# EAGLE design VL6180 (EAGLE 6.5.0)
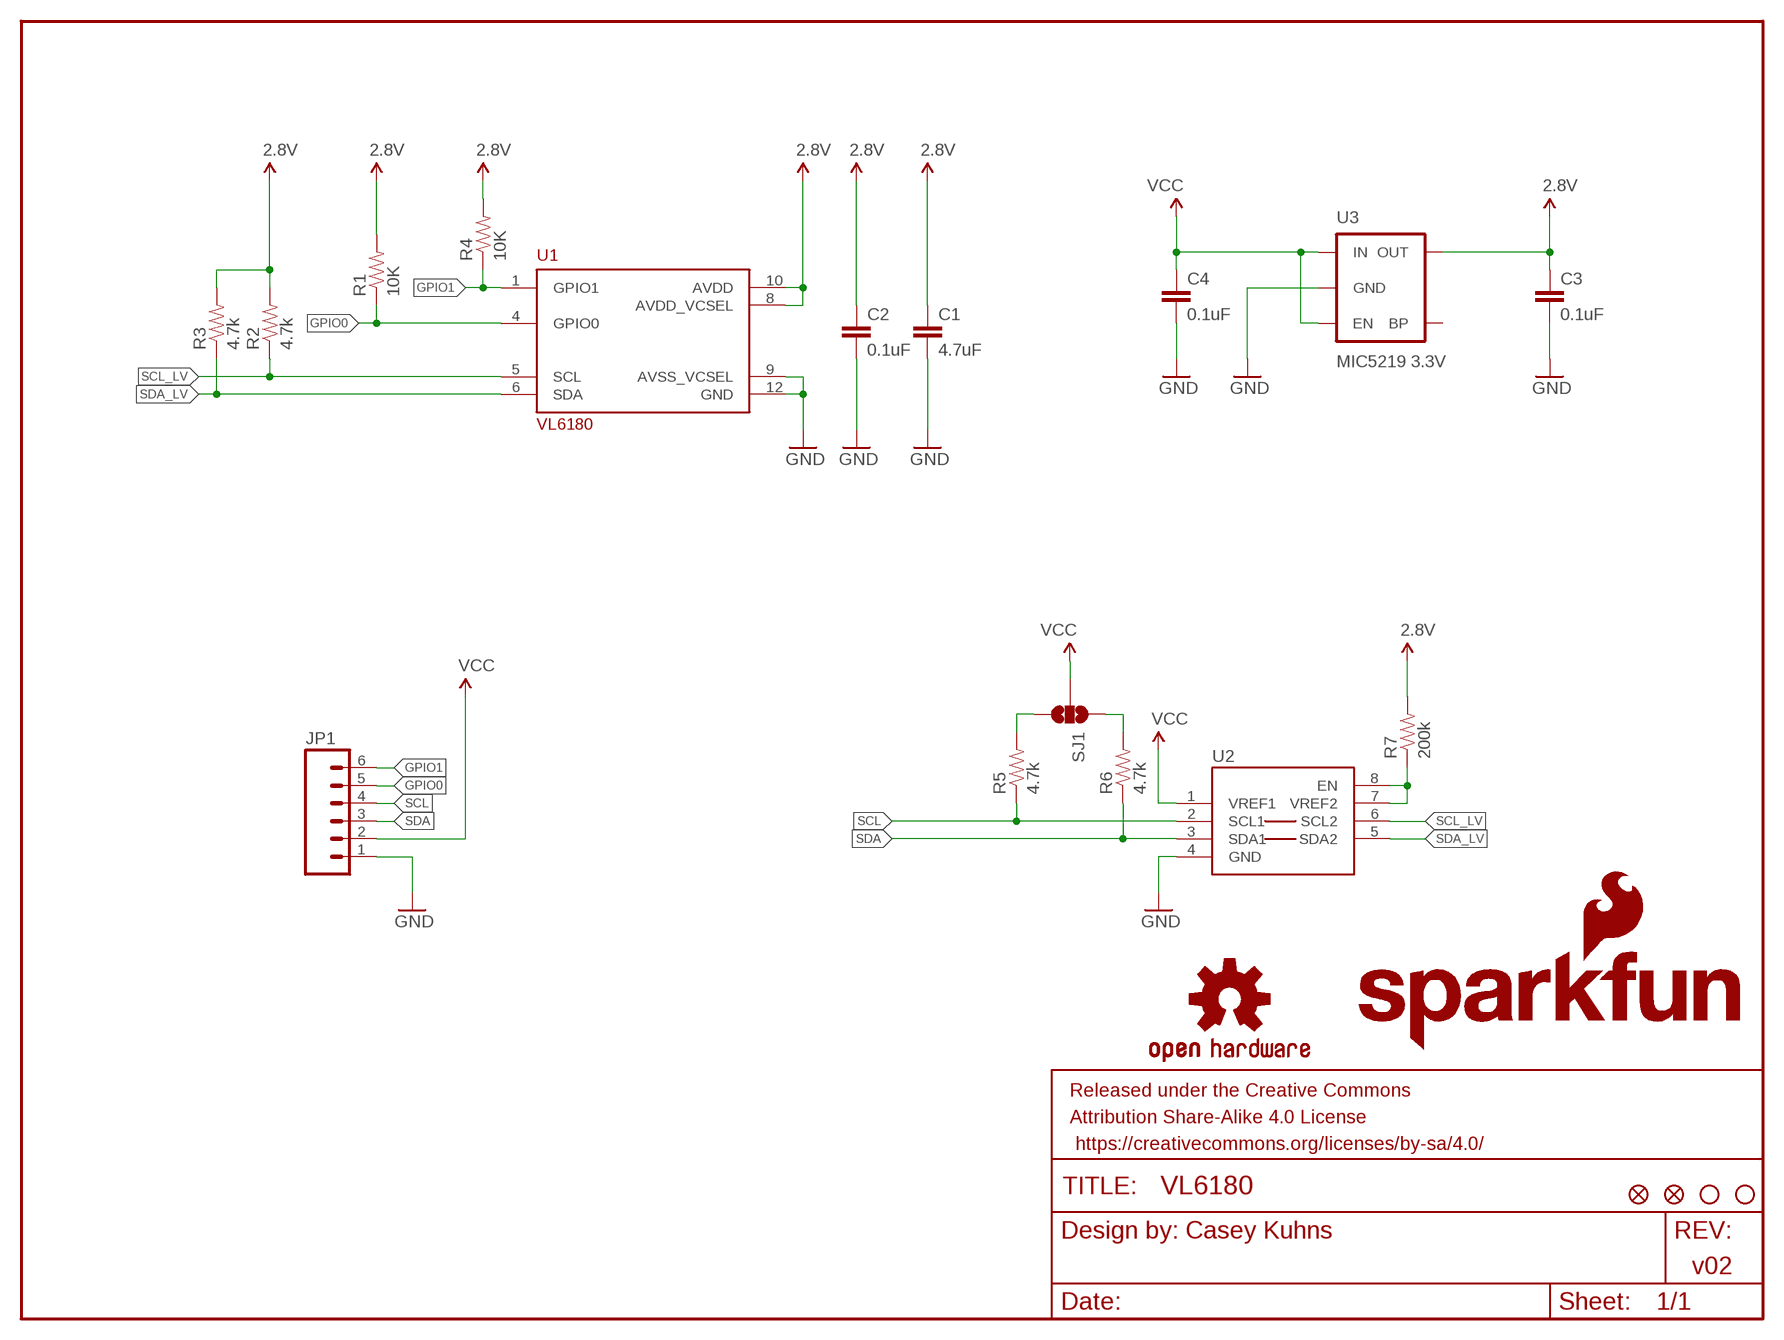
[diagram p0: schematic, sheet 1]

## Parts
C1  4.7uF  4.7UF-6.3V-10%(0603)0603  [0603-CAP]
C2  0.1uF  0.1UF-25V(+80/-20%)(0603)  [0603-CAP]
C3  0.1uF  0.1UF-25V(+80/-20%)(0603)  [0603-CAP]
C4  0.1uF  0.1UF-25V(+80/-20%)(0603)  [0603-CAP]
FID1  FIDUCIAL1X2  [FIDUCIAL-1X2]
FID2  FIDUCIAL1X2  [FIDUCIAL-1X2]
FRAME1  FRAME-LETTER  [CREATIVE_COMMONS]
JP1  M06SIP  [1X06]
LOGO1  SFE_LOGO_NAME_FLAME.1_INCH  [SFE_LOGO_NAME_FLAME_.1]
LOGO2  OSHW-LOGOS  [OSHW-LOGO-S]
R1  10K  10KOHM1/10W1%(0603)0603  [0603-RES]
R2  4.7k  4.7KOHM1/10W1%(0603)  [0603]
R3  4.7k  4.7KOHM1/10W1%(0603)  [0603]
R4  10K  10KOHM1/10W1%(0603)0603  [0603-RES]
R5  4.7k  4.7KOHM1/10W1%(0603)  [0603]
R6  4.7k  4.7KOHM1/10W1%(0603)  [0603]
R7  200k  200KOHM1/10W1%(0603)200K  [0603-RES]
SJ1  SOLDERJUMPER_2WAYPASTE1&2&3  [SJ_3_PASTE1&2&3]
STANDOFF1  STAND-OFF  [STAND-OFF]
STANDOFF2  STAND-OFF  [STAND-OFF]
U1  VL6180  [VL6180]
U2  PCA9306  [PSOP-8]
U3  MIC5219 3.3V  V_REG_MIC52193.3V  [SOT23-5]

## Nets
2.8V: C1.1 C2.1 C3.1 R1.2 R2.2 R3.2 R4.2 R7.2 U1.8(AVDD_VCSEL) U1.10(AVDD) U3.5(OUT)
GND: C1.2 C2.2 C3.2 C4.2 JP1.1 U1.9(AVSS_VCSEL) U1.12(GND) U2.4(GND) U3.2(GND)
GPIO0: JP1.5 R1.1 U1.4(GPIO0)
GPIO1: JP1.6 R4.1 U1.1(GPIO1)
N$1: R7.1 U2.7(VREF2) U2.8(EN)
N$2: R6.2 SJ1.1
N$3: R5.2 SJ1.3
SCL: JP1.4 R5.1 U2.2(SCL1)
SCL_LV: R2.1 U1.5(SCL) U2.6(SCL2)
SDA: JP1.3 R6.1 U2.3(SDA1)
SDA_LV: R3.1 U1.6(SDA) U2.5(SDA2)
VCC: C4.1 JP1.2 SJ1.2 U2.1(VREF1) U3.1(IN) U3.3(EN)
Unconnected: U3.4(BP)

## Notes on the sheet
- Casey Kuhns
- v02

## Library data of the parts
C1 = SparkFun-Capacitors:4.7UF-6.3V-10%(0603): CAP-08280; PROD_ID: CAP-08280
C2-C4 = SparkFun-Capacitors:0.1UF-25V(+80/-20%)(0603): CAP-00810 Ceramic Standard decoupling cap; PROD_ID: CAP-00810
FID1 FID2 = SparkFun-Aesthetics:FIDUCIAL: Fiducial Alignment Points Various fiducial points for machine vision alignment.
FRAME1 = SparkFun-Aesthetics:FRAME-LETTER: Schematic Frame Standard 8.5x11 US Letter frame
JP1 = SparkFun-Connectors:M06: Header 6 Standard 6-pin 0.1" header. Use with straight break away headers (SKU : PRT-00116), right angle break away headers (PRT-00553), swiss pins (PRT-00743), machine pins (PRT-00117), and female headers (PRT-00115). Molex polarized connector foot print use with SKU : PRT-08094 with associated crimp pins and housings. NOTES ON THE VARIANTS LOCK and LOCK_LONGPADS... This footprint was designed to help hold the alignment of a through-hole component (i.e. 6-pin header) while soldering it into place. You may notice that each hole has been shifted either up or down by 0.005 of an inch from it's more standard position (which is a perfectly straight line). This slight alteration caused the pins (the squares in the middle) to touch the edges of the holes. Because they are alternating, it causes a "brace" to hold the component in place. 0.005 has proven to be the perfect amount of "off-center" position when using our standard breakaway headers. Although looks a little odd when you look at the bare footprint, once you have a header in there, the alteration is very hard to notice. Also,if you push a header all the way into place, it is covered up entirely on the bottom side. This idea of altering the position of holes to aid alignment will be further integrated into the Sparkfun Library for other footprints. It can help hold any component with 3 or more connection pins.
LOGO1 = SparkFun-Aesthetics:SFE_LOGO_NAME_FLAME: SFE Logo, name and flame This is the SparkFun full logo. The logo on the schematic will always be the same size; the package variant is the height of the flame part of the logo. Default layer for the logo on the board is tSilk.
LOGO2 = SparkFun-Aesthetics:OSHW-LOGO: Open Source Hardware Logo This logo indicates the piece of hardware it is found on incorporates a OSHW license and/or adheres to the definition of open source hardware found here: http://freedomdefined.org/OSHW
R1 R4 = SparkFun-Resistors:10KOHM1/10W1%(0603): RES-00824; PROD_ID: RES-00824
R2 R3 R5 R6 = SparkFun-Resistors:4.7KOHM1/10W1%(0603): RES-07857; PROD_ID: RES-07857
R7 = SparkFun-Resistors:200KOHM1/10W1%(0603): RES-09385; PROD_ID: RES-09385
SJ1 = SparkFun-Passives:SOLDERJUMPER_2WAY: Solder Jumper 2 way solder jumper
STANDOFF1 STANDOFF2 = SparkFun-Electromechanical:STAND-OFF: #4 Stand Off This is the mechanical footprint for a #4 phillips button head screw. Use the keepout ring to avoid running the screw head into surrounding components. SKU : PRT-00447
U1 = VL6180:VL6180
U2 = SparkFun-DigitalIC:PCA9306: Bidirectional I2C level shifter. NOT compatible with all available part number pinout schemes- DOUBLE CHECK!!!; PROD_ID: IC-10023
U3 = SparkFun-PowerIC:V_REG_MIC5219: V_REG MIC5219 Standard 3.3V and 5V 500mA LDO voltage regulator in SOT-23 layout. Micrel part MIC5219. BP (by-pass) pin is used to lower output noise with 470pF cap, may be left open.; PROD_ID: VREG-09872

## Board
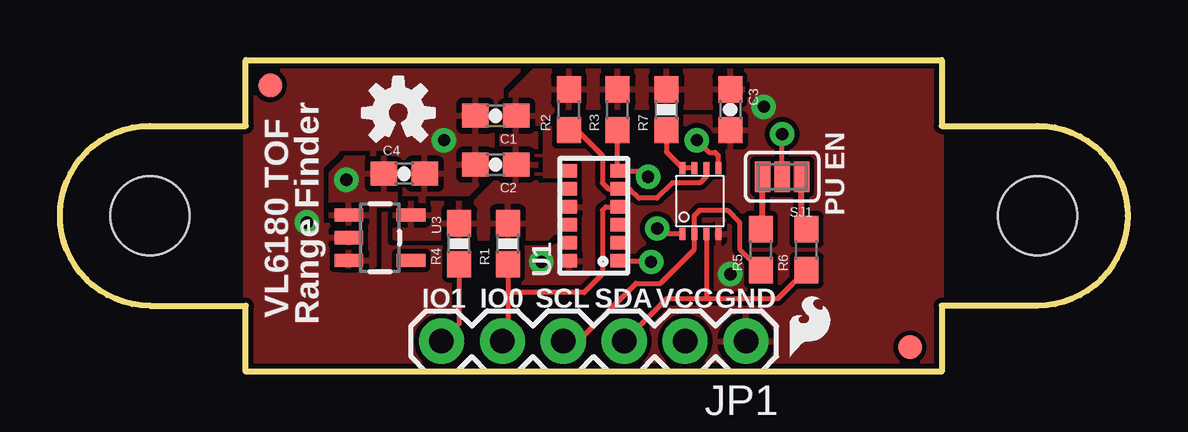
[diagram p1: board, top side]
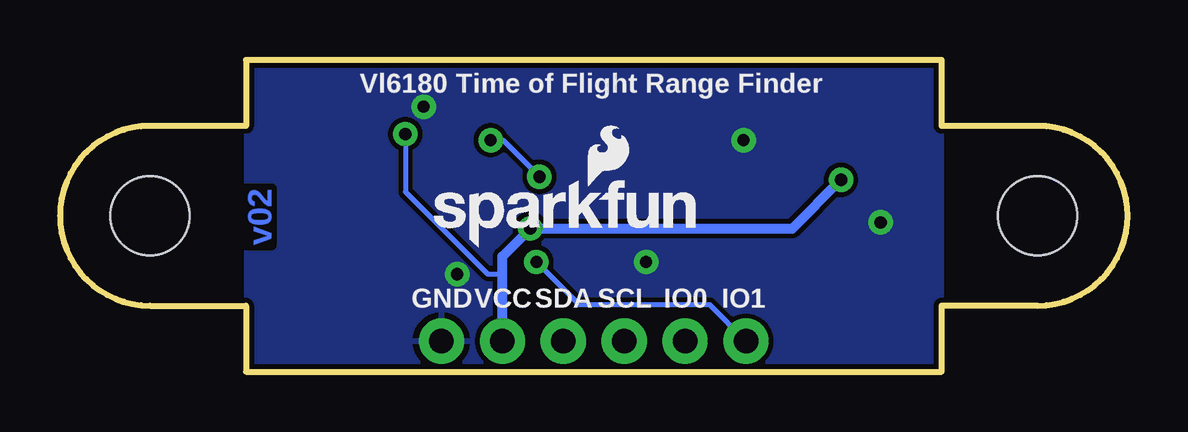
[diagram p2: board, bottom side, seen from below]

Size 44.5 x 13 mm. Coordinates in mm from the lower left corner, seen from the top.
Outline: 7.75,13 36.75,13 36.75,10.25 40.75,10.25 arc-180 40.75,2.75 36.75,2.75 36.75,0 7.75,0 7.75,2.75 3.75,2.75 arc-180 3.75,10.25 7.75,10.25 7.75,13
Copper layers (1*16): Top 0.035mm / dielectric 1.5mm / Bottom 0.035mm
Design rules "SparkFun-2-layer": minimum track width 7mil, minimum drill 15mil, track to track 8mil, track to pad 8mil, pad to pad 8mil, via to via 8mil, smd to smd 8mil, copper to edge 8mil, drill to drill 8mil, minimum pad ring 12mil, minimum via ring 10mil, stop-mask expansion 4mil, vias tented up to drill 20mil, thermal gap 10mil

### Footprints (pad centres in the part's own frame; a part is rotated, then mirrored left to right if it is on the bottom)
0603-CAP = smd 1.1 x 1: 1 -0.85,0; 2 0.85,0
FIDUCIAL-1X2 = smd 1 x 1: 1 0,0
1X06 = drill 1.016 pad 1.88: 1 0,0; 2 2.54,0; 3 5.08,0; 4 7.62,0; 5 10.16,0; 6 12.7,0
0603-RES = smd 1.1 x 1: 1 -0.85,0; 2 0.85,0
0603 = smd 1.1 x 1: 1 -0.85,0; 2 0.85,0
SJ_3_PASTE1&2&3 = smd 0.635 x 1.27: 1 -0.813,0; 2 0,0; 3 0.813,0
STAND-OFF = hole 3.302: 0,0
VL6180 = smd 0.55 x 0.6: 1 -1.875,-1; 2 -1.125,-1; 3 -0.375,-1; 4 0.375,-1; 5 1.125,-1; 6 1.875,-1; 7 1.875,1; 8 1.125,1; 9 0.375,1; 10 -0.375,1; 11 -1.125,1; 12 -1.875,1
PSOP-8 = smd 0.25 x 0.5: 1 -0.73,-1.37; 2 -0.23,-1.37; 3 0.27,-1.37; 4 0.77,-1.37; 5 0.77,1.38; 6 0.27,1.38; 7 -0.23,1.38; 8 -0.73,1.38
SOT23-5 = smd 0.55 x 1.2: 1 -0.95,-1.3; 2 0,-1.3; 3 0.95,-1.3; 4 0.95,1.3; 5 -0.95,1.3

### Placement (x,y rotation side)
C1  18.16,10.67 180 top
C2  18.16,8.64 180 top
C3  27.94,10.92 270 top
C4  14.35,8.25 0 top
FID1  8.77,11.94 0 top
FID2  35.44,1.02 0 top
FRAME1  7.75,-9.5 0 top  (outside the outline)
JP1  28.6,1.27 180 top
LOGO1  29.34,5.08 0 bottom
LOGO2  14.1,10.79 0 top
R1  18.67,5.33 90 top
R2  21.21,10.92 90 top
R3  23.24,10.92 90 top
R4  16.64,5.33 90 top
R5  29.21,5.08 90 top
R6  31.12,5.08 90 top
R7  25.28,10.92 90 top
SJ1  30.1,8.13 180 top
STANDOFF1  3.75,6.5 0 top
STANDOFF2  40.75,6.5 0 top
U1  22.25,6.5 90 top
U2  26.67,7.11 0 top
U3  13.34,5.59 270 top
U$2  [SFE_LOGO_FLAME_.1]  30.1,0.25 0 top

### Tracks (layer width: path | path; a pad name or v marks a point on that pad's centre or on a via)
2.8V
  pour Top: 13.97,6.98 13.97,5.59 20.32,5.59 20.58,5.84 21.34,5.84 21.34,6.22 20.7,6.22 20.7,7.49 21.34,7.49 21.34,7.75 19.81,7.75 19.81,10.29 20.7,11.05 28.45,11.05 28.45,12.57 19.81,12.57 18.42,11.18 18.42,8.13 17.27,6.98
GND  (via drill 0.51)
  other vias: 20.07,4.57 16,9.65 27.94,4.06 10.29,6.22 29.34,11.05
  pour Top (rank 6): 7.75,13 36.75,13 36.75,0 7.75,0
  pour Bottom: 7.75,13 36.75,13 36.75,0 7.75,0
GPIO0
  Top 0.203: R1.1 18.67,3.3 | 18.67,3.3 18.67,1.5 JP1.5 | 18.67,3.3 21.85,3.3 22.61,4.06 22.61,6.73 22.75,6.87 U1.4
GPIO1  (via drill 0.51)
  Top 0.203: R4.1 16.64,2.01 JP1.6 | U1.1 24.57,4.62 v24.64,4.57
  Bottom 0.203: v24.64,4.57 22.86,2.79 17.42,2.79 JP1.6
N$1
  Top 0.203: U2.7 U2.8 25.28,9.16 R7.1
N$2
  Top 0.254: R6.2 30.91,6.13 SJ1.1
N$3
  Top 0.254: R5.2 29.29,6.13 SJ1.3
SCL
  Top 0.203: JP1.4 21.59,1.27 24.01,3.68 25.02,3.68 26.44,5.1 U2.2 26.44,6.5 26.67,6.73 27.82,6.73 28.32,6.22 28.32,5.12 R5.1
SCL_LV
  Top 0.203: R2.1 21.55,10.07 22.61,9.02 22.61,7.87 22.86,7.62 U1.5 23.75,7.62 24.13,7.24 24.89,7.24 25.53,7.87 26.67,7.87 26.94,8.14 U2.6
SDA
  Top 0.203: JP1.3 25.3,3.05 26.93,3.05 | 26.93,3.05 29.94,3.05 R6.1 | U2.3 26.94,3.06 26.93,3.05
SDA_LV  (via drill 0.51)
  Top 0.203: R3.1 U1.6 24.27,8.37 v24.51,8.13 | v26.55,9.65 27.05,9.14 27.31,9.14 27.43,9.02 27.44,9.01 U2.5
  Bottom 0.203: v24.51,8.13 26.04,9.65 v26.55,9.65
VCC  (via drill 0.51)
  Top 0.203: SJ1.2 v30.1,9.91 | U2.1 25.12,5.74 v24.89,5.97
  Bottom 0.203: v30.1,9.91 30.1,7.49 26.67,4.06 26.19,4.06 26.06,4.19
  Bottom 0.406: JP1.2 26.06,4.19 26.06,4.8 v24.89,5.97 13.97,5.97 v11.94,8
  pour Top (rank 2): 11.31,6.22 12.7,6.22 12.7,4.95 11.56,4.95 11.56,4.44 13.08,4.44 13.08,6.98 13.97,6.98 13.97,8.89 11.94,8.89 11.31,8.25

### Text on the board
Bottom: v02
tPlace: PU EN | VL6180 TOF | Range Finder | IO1 | IO0 | SCL | SDA | VCC | GND
bPlace: Vl6180 Time of Flight Range Finder | IO1 | IO0 | SCL | SDA | VCC | GND
tDocu: Casey Kuhns